# EAGLE design schematics (EAGLE 9.6.2)
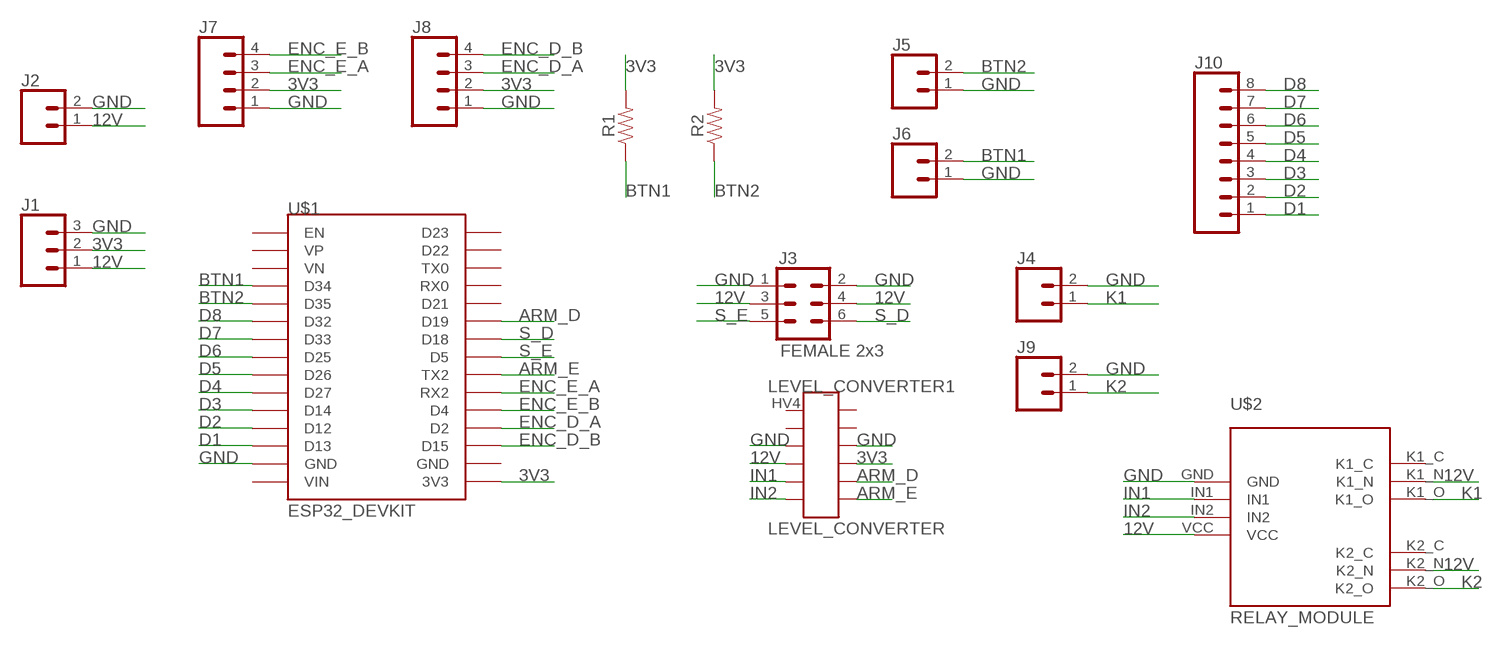
[diagram p0: schematic, sheet 1]

## Parts
J1  CONN_03LOCK  [1X03_LOCK]
J2  CONN_02LOCK  [1X02_LOCK]
J3  FEMALE 2x3  CONN_03X2FEMALE  [2X3]
J4  CONN_02PTH4  [1X02_XTRA_BIG]
J5  CONN_02LOCK  [1X02_LOCK]
J6  CONN_02LOCK  [1X02_LOCK]
J7  CONN_04LOCK  [1X04_LOCK]
J8  CONN_04LOCK  [1X04_LOCK]
J9  CONN_02PTH4  [1X02_XTRA_BIG]
J10  CONN_08LOCK  [1X08_LOCK]
LEVEL_CONVERTER1  LEVEL_CONVERTER  [LEVEL_CONVERTER]
R1  RESISTORAXIAL-0.3  [AXIAL-0.3]
R2  RESISTORAXIAL-0.3  [AXIAL-0.3]
U$1  ESP32_DEVKIT  [ESP32_DEVKIT]
U$2  RELAY_MODULE  [RELAY_MODULE]

## Nets
3V3: J1.2 J7.2 J8.2 LEVEL_CONVERTER1.LV R1.P$2 R2.P$2 U$1.3V3
12V: J1.1 J2.1 J3.3 J3.4 LEVEL_CONVERTER1.HV U$2.K1_N U$2.K2_N U$2.VCC
ARM_D: LEVEL_CONVERTER1.LV2 U$1.D19
ARM_E: LEVEL_CONVERTER1.LV1 U$1.TX2
BTN1: J6.2 R1.P$1 U$1.D34
BTN2: J5.2 R2.P$1 U$1.D35
D1: J10.1 U$1.D13
D2: J10.2 U$1.D12
D3: J10.3 U$1.D14
D4: J10.4 U$1.D27
D5: J10.5 U$1.D26
D6: J10.6 U$1.D25
D7: J10.7 U$1.D33
D8: J10.8 U$1.D32
ENC_D_A: J8.3 U$1.D2
ENC_D_B: J8.4 U$1.D15
ENC_E_A: J7.3 U$1.RX2
ENC_E_B: J7.4 U$1.D4
GND: J1.3 J2.2 J3.1 J3.2 J4.2 J5.1 J6.1 J7.1 J8.1 J9.2 LEVEL_CONVERTER1.GNDH LEVEL_CONVERTER1.GNDL U$1.GND@1(GND) U$2.GND
IN1: LEVEL_CONVERTER1.HV2 U$2.IN1
IN2: LEVEL_CONVERTER1.HV1 U$2.IN2
K1: J4.1 U$2.K1_O
K2: J9.1 U$2.K2_O
S_D: J3.6 U$1.D18
S_E: J3.5 U$1.D5
Unconnected: LEVEL_CONVERTER1.HV3 LEVEL_CONVERTER1.HV4 LEVEL_CONVERTER1.LV3 LEVEL_CONVERTER1.LV4 U$1.D21 U$1.D22 U$1.D23 U$1.EN U$1.GND@2(GND) U$1.RX0 U$1.TX0 U$1.VIN U$1.VN U$1.VP U$2.K1_C U$2.K2_C

## Library data of the parts
J1 = SparkFun-Connectors:CONN_03: Multi connection point. Often used as Generic Header-pin footprint for 0.1 inch spaced/style header connections On any of the 0.1 inch spaced packages, you can populate with these: Break Away Headers - Straight <https://www.sparkfun.com/products/116> (PRT-00116) Break Away Male Headers - Right Angle <https://www.sparkfun.com/products/553> (PRT-00553) Female Headers <https://www.sparkfun.com/products/115> (PRT-00115) Break Away Headers - Machine Pin <https://www.sparkfun.com/products/117> (PRT-00117) Break Away Female Headers - Swiss Machine Pin <https://www.sparkfun.com/products/743> (PRT-00743) Stackable Header - 3 Pin (Female, 0.1") <https://www.sparkfun.com/products/13875> (PRT-13875) For SCREWTERMINALS and SPRING TERMINALS visit here: Screw Terimnals on SparkFun.com <https://www.sparkfun.com/search/results?term=Screw+Terminals> (5mm/3.5mm/2.54mm spacing) This device is also useful as a general connection point to wire up your design to another part of your project. Our various solder wires solder well into these plated through hole pads. Hook-Up Wire - Assortment (Stranded, 22 AWG) <https://www.sparkfun.com/products/11375> (PRT-11375) Hook-Up Wire - Assortment (Solid Core, 22 AWG) <https://www.sparkfun.com/products/11367> (PRT-11367) View the entire wire category on our website here <https://www.sparkfun.com/categories/141> Special notes: Molex polarized connector foot print use with SKU : PRT-08232 with associated crimp pins and housings.
J2 J4-J6 J9 = SparkFun-Connectors:CONN_02: Multi connection point. Often used as Generic Header-pin footprint for 0.1 inch spaced/style header connections On any of the 0.1 inch spaced packages, you can populate with these: Break Away Headers - Straight <https://www.sparkfun.com/products/116> (PRT-00116) Break Away Male Headers - Right Angle <https://www.sparkfun.com/products/553> (PRT-00553) Female Headers <https://www.sparkfun.com/products/115> (PRT-00115) Break Away Headers - Machine Pin <https://www.sparkfun.com/products/117> (PRT-00117) Break Away Female Headers - Swiss Machine Pin <https://www.sparkfun.com/products/743> (PRT-00743) For SCREWTERMINALS and SPRING TERMINALS visit here: Screw Terimnals on SparkFun.com <https://www.sparkfun.com/search/results?term=Screw+Terminals> (5mm/3.5mm/2.54mm spacing) This device is also useful as a general connection point to wire up your design to another part of your project. Our various solder wires solder well into these plated through hole pads. Hook-Up Wire - Assortment (Stranded, 22 AWG) <https://www.sparkfun.com/products/11375> (PRT-11375) Hook-Up Wire - Assortment (Solid Core, 22 AWG) <https://www.sparkfun.com/products/11367> (PRT-11367) View the entire wire category on our website here <https://www.sparkfun.com/categories/141> Special notes: Molex polarized connector foot print use with: PRT-08233 with associated crimp pins and housings. 2.54_SCREWTERM for use with PRT-10571. 3.5mm Screw Terminal footprints for PRT-08084 5mm Screw Terminal footprints for use with PRT-08432
J3 = SparkFun-Connectors:CONN_03X2: Multi connection point. Often used as Generic Header-pin footprint for 0.1 inch spaced/style header connections You can populate with any combo of single row headers, but if you'd like an exact match, check these: Header - 2x3 (Male, 0.1") <https://www.sparkfun.com/products/12807> (PRT-12807) Header - 2x3 (Female, 0.1") <https://www.sparkfun.com/products/13010> (PRT-13010) 2x3 Pin Shrouded Header <https://www.sparkfun.com/products/10877> (PRT-10877) On any of the 0.1 inch spaced packages, you can populate with these: Break Away Headers - Straight <https://www.sparkfun.com/products/116> (PRT-00116) Break Away Male Headers - Right Angle <https://www.sparkfun.com/products/553> (PRT-00553) Female Headers <https://www.sparkfun.com/products/115> (PRT-00115) Break Away Headers - Machine Pin <https://www.sparkfun.com/products/117> (PRT-00117) Break Away Female Headers - Swiss Machine Pin <https://www.sparkfun.com/products/743> (PRT-00743) Special note: the shrouded connector mates well with our 3x2 ribbon cables: Ribbon Crimp Connector - 6-pin (2x3, Female) <https://www.sparkfun.com/products/10651> (PRT-10651) Ribbon Cable - 6 wire (15ft) <https://www.sparkfun.com/products/10646> (PRT-10646); PROD_ID: CONN-11566
J7 J8 = SparkFun-Connectors:CONN_04: Multi connection point. Often used as Generic Header-pin footprint for 0.1 inch spaced/style header connections On any of the 0.1 inch spaced packages, you can populate with these: Break Away Headers - Straight <https://www.sparkfun.com/products/116> (PRT-00116) Break Away Male Headers - Right Angle <https://www.sparkfun.com/products/553> (PRT-00553) Female Headers <https://www.sparkfun.com/products/115> (PRT-00115) Break Away Headers - Machine Pin <https://www.sparkfun.com/products/117> (PRT-00117) Break Away Female Headers - Swiss Machine Pin <https://www.sparkfun.com/products/743> (PRT-00743) For SCREWTERMINALS and SPRING TERMINALS visit here: Screw Terimnals on SparkFun.com <https://www.sparkfun.com/search/results?term=Screw+Terminals> (5mm/3.5mm/2.54mm spacing) This device is also useful as a general connection point to wire up your design to another part of your project. Our various solder wires solder well into these plated through hole pads. Hook-Up Wire - Assortment (Stranded, 22 AWG) <https://www.sparkfun.com/products/11375> (PRT-11375) Hook-Up Wire - Assortment (Solid Core, 22 AWG) <https://www.sparkfun.com/products/11367> (PRT-11367) View the entire wire category on our website here <https://www.sparkfun.com/categories/141> Special notes: Molex polarized connector foot print use with SKU : PRT-08231 with associated crimp pins and housings. 1MM SMD Version SKU: PRT-10208; PROD_ID: CONN-09696
J10 = SparkFun-Connectors:CONN_08: Multi connection point. Often used as Generic Header-pin footprint for 0.1 inch spaced/style header connections On any of the 0.1 inch spaced packages, you can populate with these: Break Away Headers - Straight <https://www.sparkfun.com/products/116> (PRT-00116) Break Away Male Headers - Right Angle <https://www.sparkfun.com/products/553> (PRT-00553) Female Headers <https://www.sparkfun.com/products/115> (PRT-00115) Break Away Headers - Machine Pin <https://www.sparkfun.com/products/117> (PRT-00117) Break Away Female Headers - Swiss Machine Pin <https://www.sparkfun.com/products/743> (PRT-00743) Arduino Stackable Header - 8 Pin <https://www.sparkfun.com/products/9279> (PRT-09279) For SCREWTERMINALS and SPRING TERMINALS visit here: Screw Terimnals on SparkFun.com <https://www.sparkfun.com/search/results?term=Screw+Terminals> (5mm/3.5mm/2.54mm spacing) This device is also useful as a general connection point to wire up your design to another part of your project. Our various solder wires solder well into these plated through hole pads. Hook-Up Wire - Assortment (Stranded, 22 AWG) <https://www.sparkfun.com/products/11375> (PRT-11375) Hook-Up Wire - Assortment (Solid Core, 22 AWG) <https://www.sparkfun.com/products/11367> (PRT-11367) View the entire wire category on our website here <https://www.sparkfun.com/categories/141> Special notes: Molex polarized connector foot print use with SKU : PRT-08231 with associated crimp pins and housings. 1MM SMD Version SKU: PRT-10208 NOTES ON THE VARIANTS LOCK and LOCK_LONGPADS... This footprint was designed to help hold the alignment of a through-hole component (i.e. 6-pin header) while soldering it into place. You may notice that each hole has been shifted either up or down by 0.005 of an inch from it's more standard position (which is a perfectly straight line). This slight alteration caused the pins (the squares in the middle) to touch the edges of the holes. Because they are alternating, it causes a "brace" to hold the component in place. 0.005 has proven to be the perfect amount of "off-center" position when using our standard breakaway headers. Although looks a little odd when you look at the bare footprint, once you have a header in there, the alteration is very hard to notice. Also,if you push a header all the way into place, it is covered up entirely on the bottom side.
LEVEL_CONVERTER1 = minhas_libs:LEVEL_CONVERTER
R1 R2 = SparkFun-Resistors:RESISTOR: Generic Resistor Package
U$1 = esp32:ESP32_DEVKIT: ESP32 DEVKIT BOARD
U$2 = relay_module:RELAY_MODULE

## Board
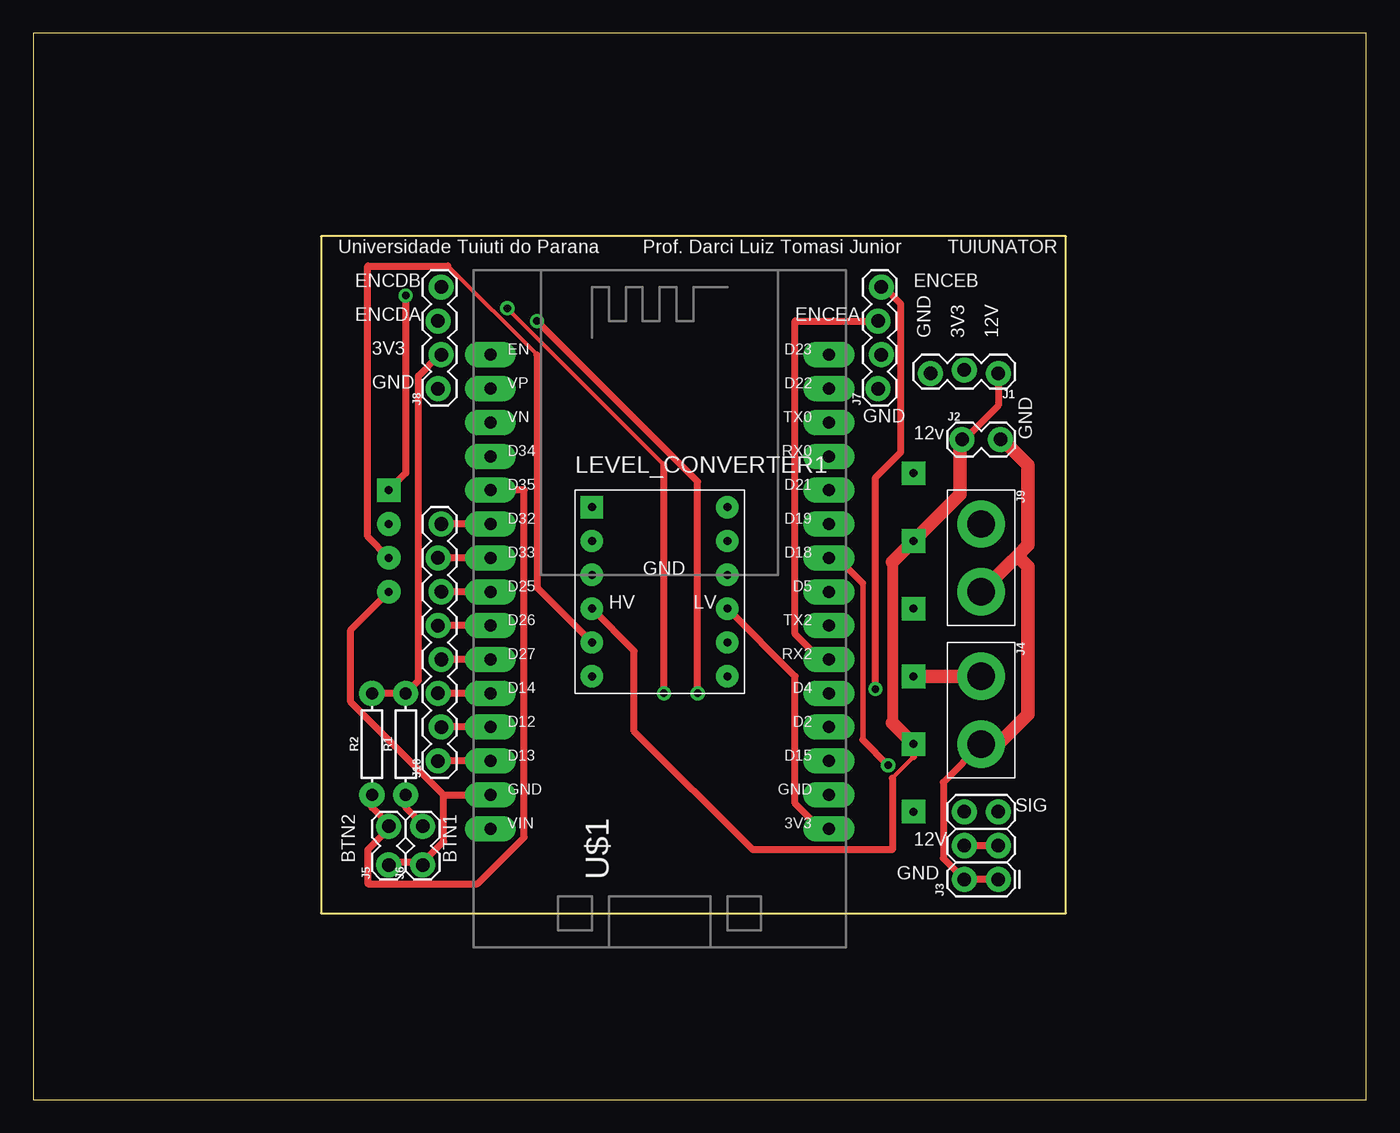
[diagram p1: board, top side]
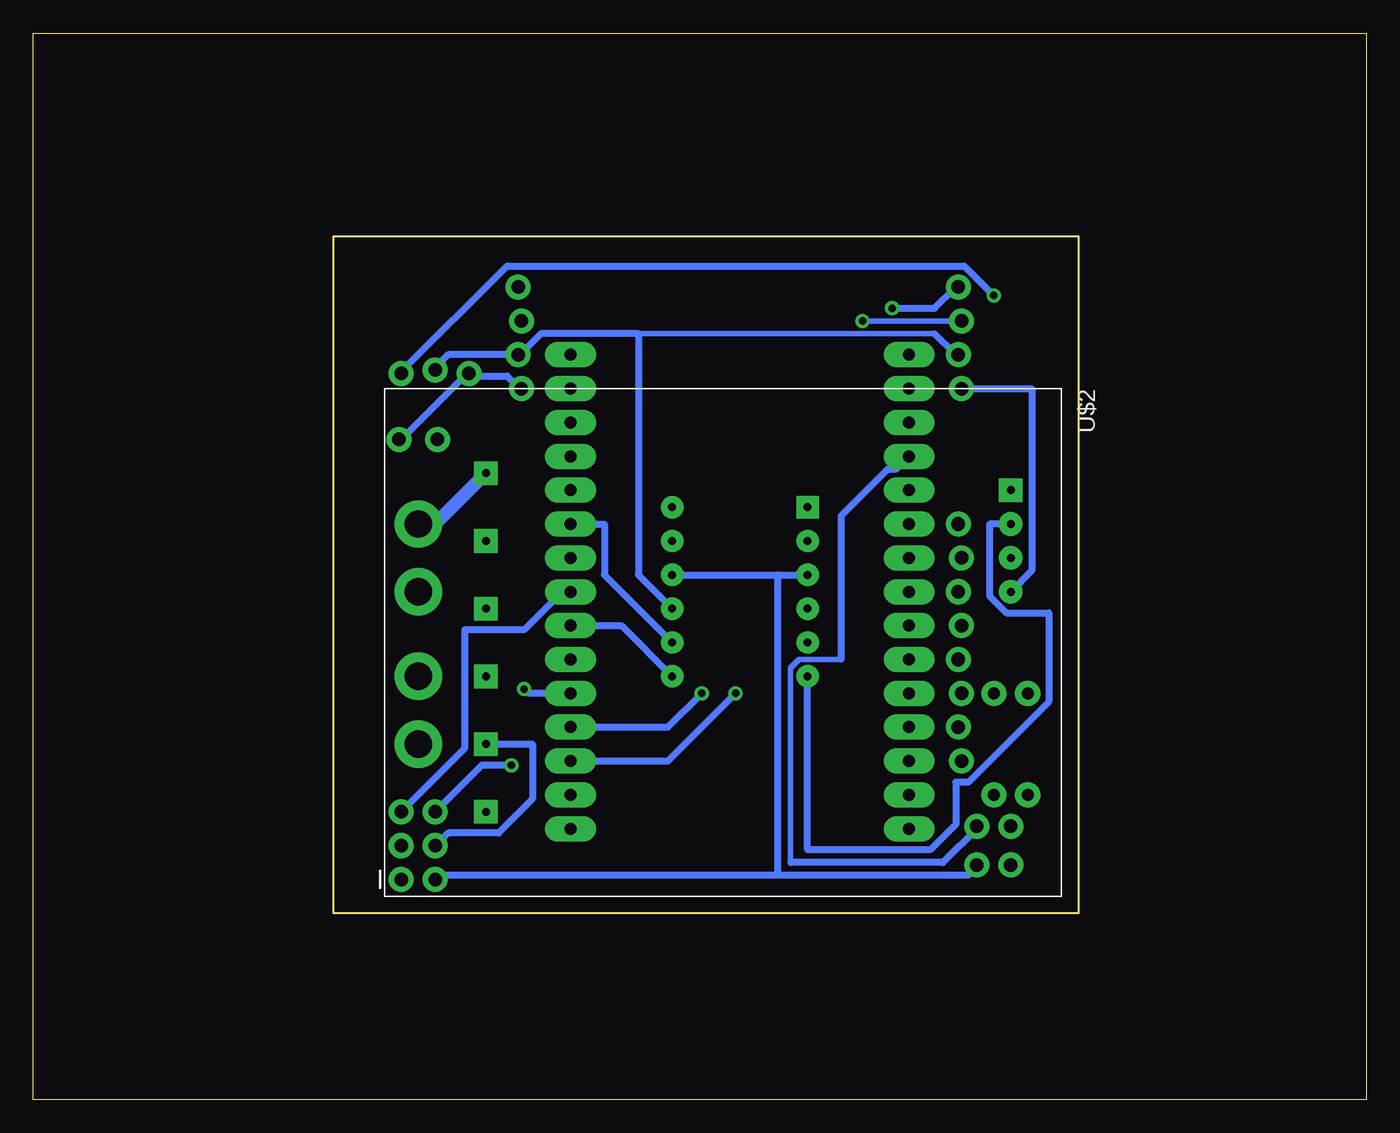
[diagram p2: board, bottom side, seen from below]

Size 100 x 80 mm. Coordinates in mm from the lower left corner, seen from the top.
Outline: 0,0 100,0 100,80 0,80 0,0
Outline: 21.59,13.97 77.47,13.97 77.47,64.77 21.59,64.77 21.59,13.97
Copper layers (1*16): Top 0.035mm / dielectric 1.5mm / Bottom 0.035mm
Design rules "SparkFun": minimum track width 8mil, minimum drill 20mil, track to track 8mil, track to pad 8mil, pad to pad 8mil, via to via 8mil, smd to smd 8mil, copper to edge 8mil, drill to drill 8mil, minimum pad ring 12mil, minimum via ring 10mil, stop-mask expansion 4mil, vias tented up to drill 20mil, thermal gap 10mil

### Footprints (pad centres in the part's own frame; a part is rotated, then mirrored left to right if it is on the bottom)
1X03_LOCK = drill 1.016 pad 1.88: 1 0,0.127; 2 2.54,-0.127; 3 5.08,0.127
1X02_LOCK = drill 1.016 pad 1.88: 1 -0.178,0; 2 2.718,0
2X3 = drill 1.016 pad 1.88: 1 0,0; 2 0,2.54; 3 2.54,0; 4 2.54,2.54; 5 5.08,0; 6 5.08,2.54
1X02_XTRA_BIG = drill 2.057 pad 3.556: 1 -2.54,0; 2 2.54,0
1X04_LOCK = drill 1.016 pad 1.88: 1 0,0.127; 2 2.54,-0.127; 3 5.08,0.127; 4 7.62,-0.127
1X08_LOCK = drill 1.016 pad 1.88: 1 0,0.127; 2 2.54,-0.127; 3 5.08,0.127; 4 7.62,-0.127; 5 10.16,0.127; 6 12.7,-0.127; 7 15.24,0.127; 8 17.78,-0.127
LEVEL_CONVERTER = drill 0.6 pad 1.676: GNDH 1.27,-6.35; GNDL 11.43,-6.35; HV 1.27,-8.89; HV1 1.27,-13.97; HV2 1.27,-11.43; HV3 1.27,-3.81; LV 11.43,-8.89; LV1 11.43,-13.97; LV2 11.43,-11.43; LV3 11.43,-3.81; LV4 11.43,-1.27 | drill 0.6 pad 1.676 square: HV4 1.27,-1.27
AXIAL-0.3 = drill 0.9 pad 1.88: P$1 -3.81,0; P$2 3.81,0
ESP32_DEVKIT = drill 0.9 pad 1.93 long: 3V3 11.43,-17.78; D2 11.43,-10.16; D4 11.43,-7.62; D5 11.43,0; D12 -13.97,-10.16; D13 -13.97,-12.7; D14 -13.97,-7.62; D15 11.43,-12.7; D18 11.43,2.54; D19 11.43,5.08; D21 11.43,7.62; D22 11.43,15.24; D23 11.43,17.78; D25 -13.97,0; D26 -13.97,-2.54; D27 -13.97,-5.08; D32 -13.97,5.08; D33 -13.97,2.54; D34 -13.97,10.16; D35 -13.97,7.62; EN -13.97,17.78; GND@1 -13.97,-15.24; GND@2 11.43,-15.24; RX0 11.43,10.16; RX2 11.43,-5.08; TX0 11.43,12.7; TX2 11.43,-2.54; VIN -13.97,-17.78; VN -13.97,12.7; VP -13.97,15.24
RELAY_MODULE = drill 0.6 pad 1.778: GND 15.24,-3.81; IN1 12.7,-3.81; IN2 10.16,-3.81 | drill 0.6 pad 1.778 square: K1_C 31.75,-43.18; K1_N 26.67,-43.18; K1_O 21.59,-43.18; K2_C 16.51,-43.18; K2_N 11.43,-43.18; K2_O 6.35,-43.18; VCC 7.62,-3.81

### Placement (x,y rotation side)
J1  72.39,54.61 180 top
J2  69.85,49.53 0 top
J3  72.39,16.51 90 top
J4  71.12,29.21 270 top
J5  26.67,17.78 90 top
J6  29.21,17.78 90 top
J7  63.5,53.34 90 top
J8  30.48,53.34 90 top
J9  71.12,40.64 270 top
J10  30.48,25.4 90 top
LEVEL_CONVERTER1  40.64,45.72 0 top
R1  27.94,26.67 90 top
R2  25.4,26.67 90 top
U$1  48.26,38.1 0 top
U$2  22.86,53.34 270 bottom

### Tracks (layer width: path | path; a pad name or v marks a point on that pad's centre or on a via)
3V3
  Top 0.508: LEVEL_CONVERTER1.LV 57.15,31.75 57.15,22.23 59.05,20.32 U$1.3V3 | R2.P$2 R1.P$2 28.89,31.43 28.89,54.29 30.48,55.88 J8.2
  Bottom 0.406: 32.38,57.47 54.61,57.47
  Bottom 0.508: J1.2 69.85,54.93 68.9,55.88 J7.2 63.5,55.88 61.91,57.47 54.61,57.47 54.61,39.37 LEVEL_CONVERTER1.LV | 32.38,57.47 30.8,55.88 J8.2
12V  (via drill 0.55)
  Top 0.305: 66.04,25.72 64.45,24.13
  Top 0.508: J3.3 J3.4 | LEVEL_CONVERTER1.HV 45.09,33.66 45.09,27.62 53.98,18.73 64.45,18.73 64.45,24.13 | U$2.K1_N 66.04,25.72 | 69.53,49.53 J2.1 69.85,49.53 72.39,52.07 J1.1 | U$2.VCC 27.94,46.99 v27.94,60.33
  Top 0.813: 64.45,40.32 64.45,28.26
  Top 1.016: 69.53,49.53 69.53,45.4 U$2.K2_N 64.45,40.32 | 64.45,28.26 U$2.K1_N
  Bottom 0.508: J3.4 68.9,20 65.09,20 62.55,22.54 62.55,26.67 U$2.K1_N | v27.94,60.33 30.16,62.55 64.45,62.55 72.39,54.61 J1.1
ARM_D
  Bottom 0.508: LEVEL_CONVERTER1.LV2 57.15,39.37 57.15,43.18 U$1.D19
ARM_E
  Bottom 0.508: LEVEL_CONVERTER1.LV1 55.88,35.56 U$1.TX2
BTN1
  Top 0.508: R1.P$1 27.94,21.91 29.21,20.64 J6.2
  Bottom 0.406: 39.37,33.02 42.55,33.02 43.18,32.38 43.18,17.78
  Bottom 0.508: U$1.D34 35.24,47.31 35.88,47.31 39.37,43.81 39.37,33.02 | 43.18,17.78 31.75,17.78 29.21,20.32 J6.2
BTN2
  Top 0.508: R2.P$1 25.4,21.91 26.67,20.64 J5.2 26.67,20.32 25.08,18.73 25.08,16.19 33.34,16.19 36.83,19.68 36.83,45.72 U$1.D35
D1
  Top 0.508: U$1.D13 J10.1
D2
  Top 0.508: U$1.D12 J10.2
D3
  Top 0.508: U$1.D14 J10.3
D4
  Top 0.508: U$1.D27 J10.4
D5
  Top 0.508: U$1.D26 J10.5
D6
  Top 0.508: U$1.D25 J10.6
D7
  Top 0.508: U$1.D33 J10.7
D8
  Top 0.508: U$1.D32 J10.8
ENC_D_A  (via drill 0.55)
  Top 0.508: v37.78,58.42 49.85,46.35 v49.85,30.48
  Bottom 0.406: v37.78,58.42 J8.3
  Bottom 0.508: v49.85,30.48 52.39,27.94 U$1.D2
ENC_D_B  (via drill 0.55)
  Top 0.305: 47.31,47.62 v35.56,59.37
  Top 0.508: v47.31,30.48 47.31,47.62
  Bottom 0.508: v35.56,59.37 32.38,59.37 30.8,60.96 J8.4 | v47.31,30.48 52.39,25.4 U$1.D15
ENC_E_A
  Top 0.508: J7.3 57.15,58.42 57.15,34.92 59.05,33.02 U$1.RX2
ENC_E_B  (via drill 0.55)
  Top 0.508: v63.18,30.8 63.18,46.67 65.09,48.58 65.09,59.69 63.82,60.96 J7.4
  Bottom 0.508: v63.18,30.8 62.87,30.48 U$1.D4
GND
  Top 0.508: J3.1 J3.2 68.26,18.1 68.26,23.81 J4.2 | 72.71,49.53 J2.2 | 29.21,17.78 26.67,17.78 J5.1 | 30.8,22.86 U$1.GND@1 | 30.8,22.86 30.8,19.37 29.21,17.78 | 29.21,17.78 J6.1 | U$2.GND 23.81,35.24 23.81,29.84 30.8,22.86
  Top 1.016: 73.82,40.8 74.61,41.59 74.61,47.62 72.71,49.53 | 73.82,40.8 73.18,40.16 J9.2 | J4.2 72.39,26.67 74.61,28.89 74.61,40.01 73.82,40.8
  Bottom 0.508: 67.31,54.29 64.45,54.29 63.5,53.34 J7.1 | 67.31,54.29 67.63,54.29 72.39,49.53 J2.2 | 67.31,54.29 J1.3 | U$2.GND 25.08,39.69 25.08,53.34 J8.1 | LEVEL_CONVERTER1.GNDL 44.13,39.37 | 44.13,39.37 LEVEL_CONVERTER1.GNDH | 44.13,16.83 44.13,39.37 | 44.13,16.83 29.84,16.83 29.21,17.46 J6.1 | J3.2 69.53,16.83 44.13,16.83
IN1
  Top 0.305: 31.11,62.55 37.78,55.88
  Top 0.508: LEVEL_CONVERTER1.HV2 37.78,38.42 37.78,55.88 | 31.11,62.55 25.08,62.55 25.08,42.23 U$2.IN1
IN2
  Bottom 0.508: LEVEL_CONVERTER1.HV1 41.91,18.73 32.7,18.73 30.8,20.64 30.8,23.81 29.84,23.81 23.81,29.84 23.81,36.51 26.99,36.51 28.26,37.78 28.26,43.18 U$2.IN2
K1
  Top 1.016: J4.1 U$2.K1_O
K2
  Bottom 1.016: U$2.K2_O 69.85,43.18 J9.1
S_D  (via drill 0.55)
  Top 0.406: 62.23,38.73 62.23,26.99
  Top 0.508: 62.23,26.99 v64.14,25.08 | 62.23,38.73 60.33,40.64 U$1.D18
  Bottom 0.508: J3.6 66.36,25.08 v64.14,25.08
S_E
  Bottom 0.508: J3.5 67.63,26.35 67.63,35.24 63.18,35.24 60.33,38.1 U$1.D5

### Text on the board
tPlace: Universidade Tuiuti do Parana | Prof. Darci Luiz Tomasi Junior | TUIUNATOR | ENCDB | ENCEB | ENCDA | ENCEA | GND | 3V3 | 12V | 3V3 | GND | GND | 12v | GND | GND | HV | LV | SIG | 12V | BTN2 | BTN1 | GND